# EasyEDA schematic SCH_AB1805_2025-06-08.json
TITLE: Tarjeta electrónica LURMIS; REV: 1.0; Date: 2024-08-15; Sheet: 1/1; Company: UNIR
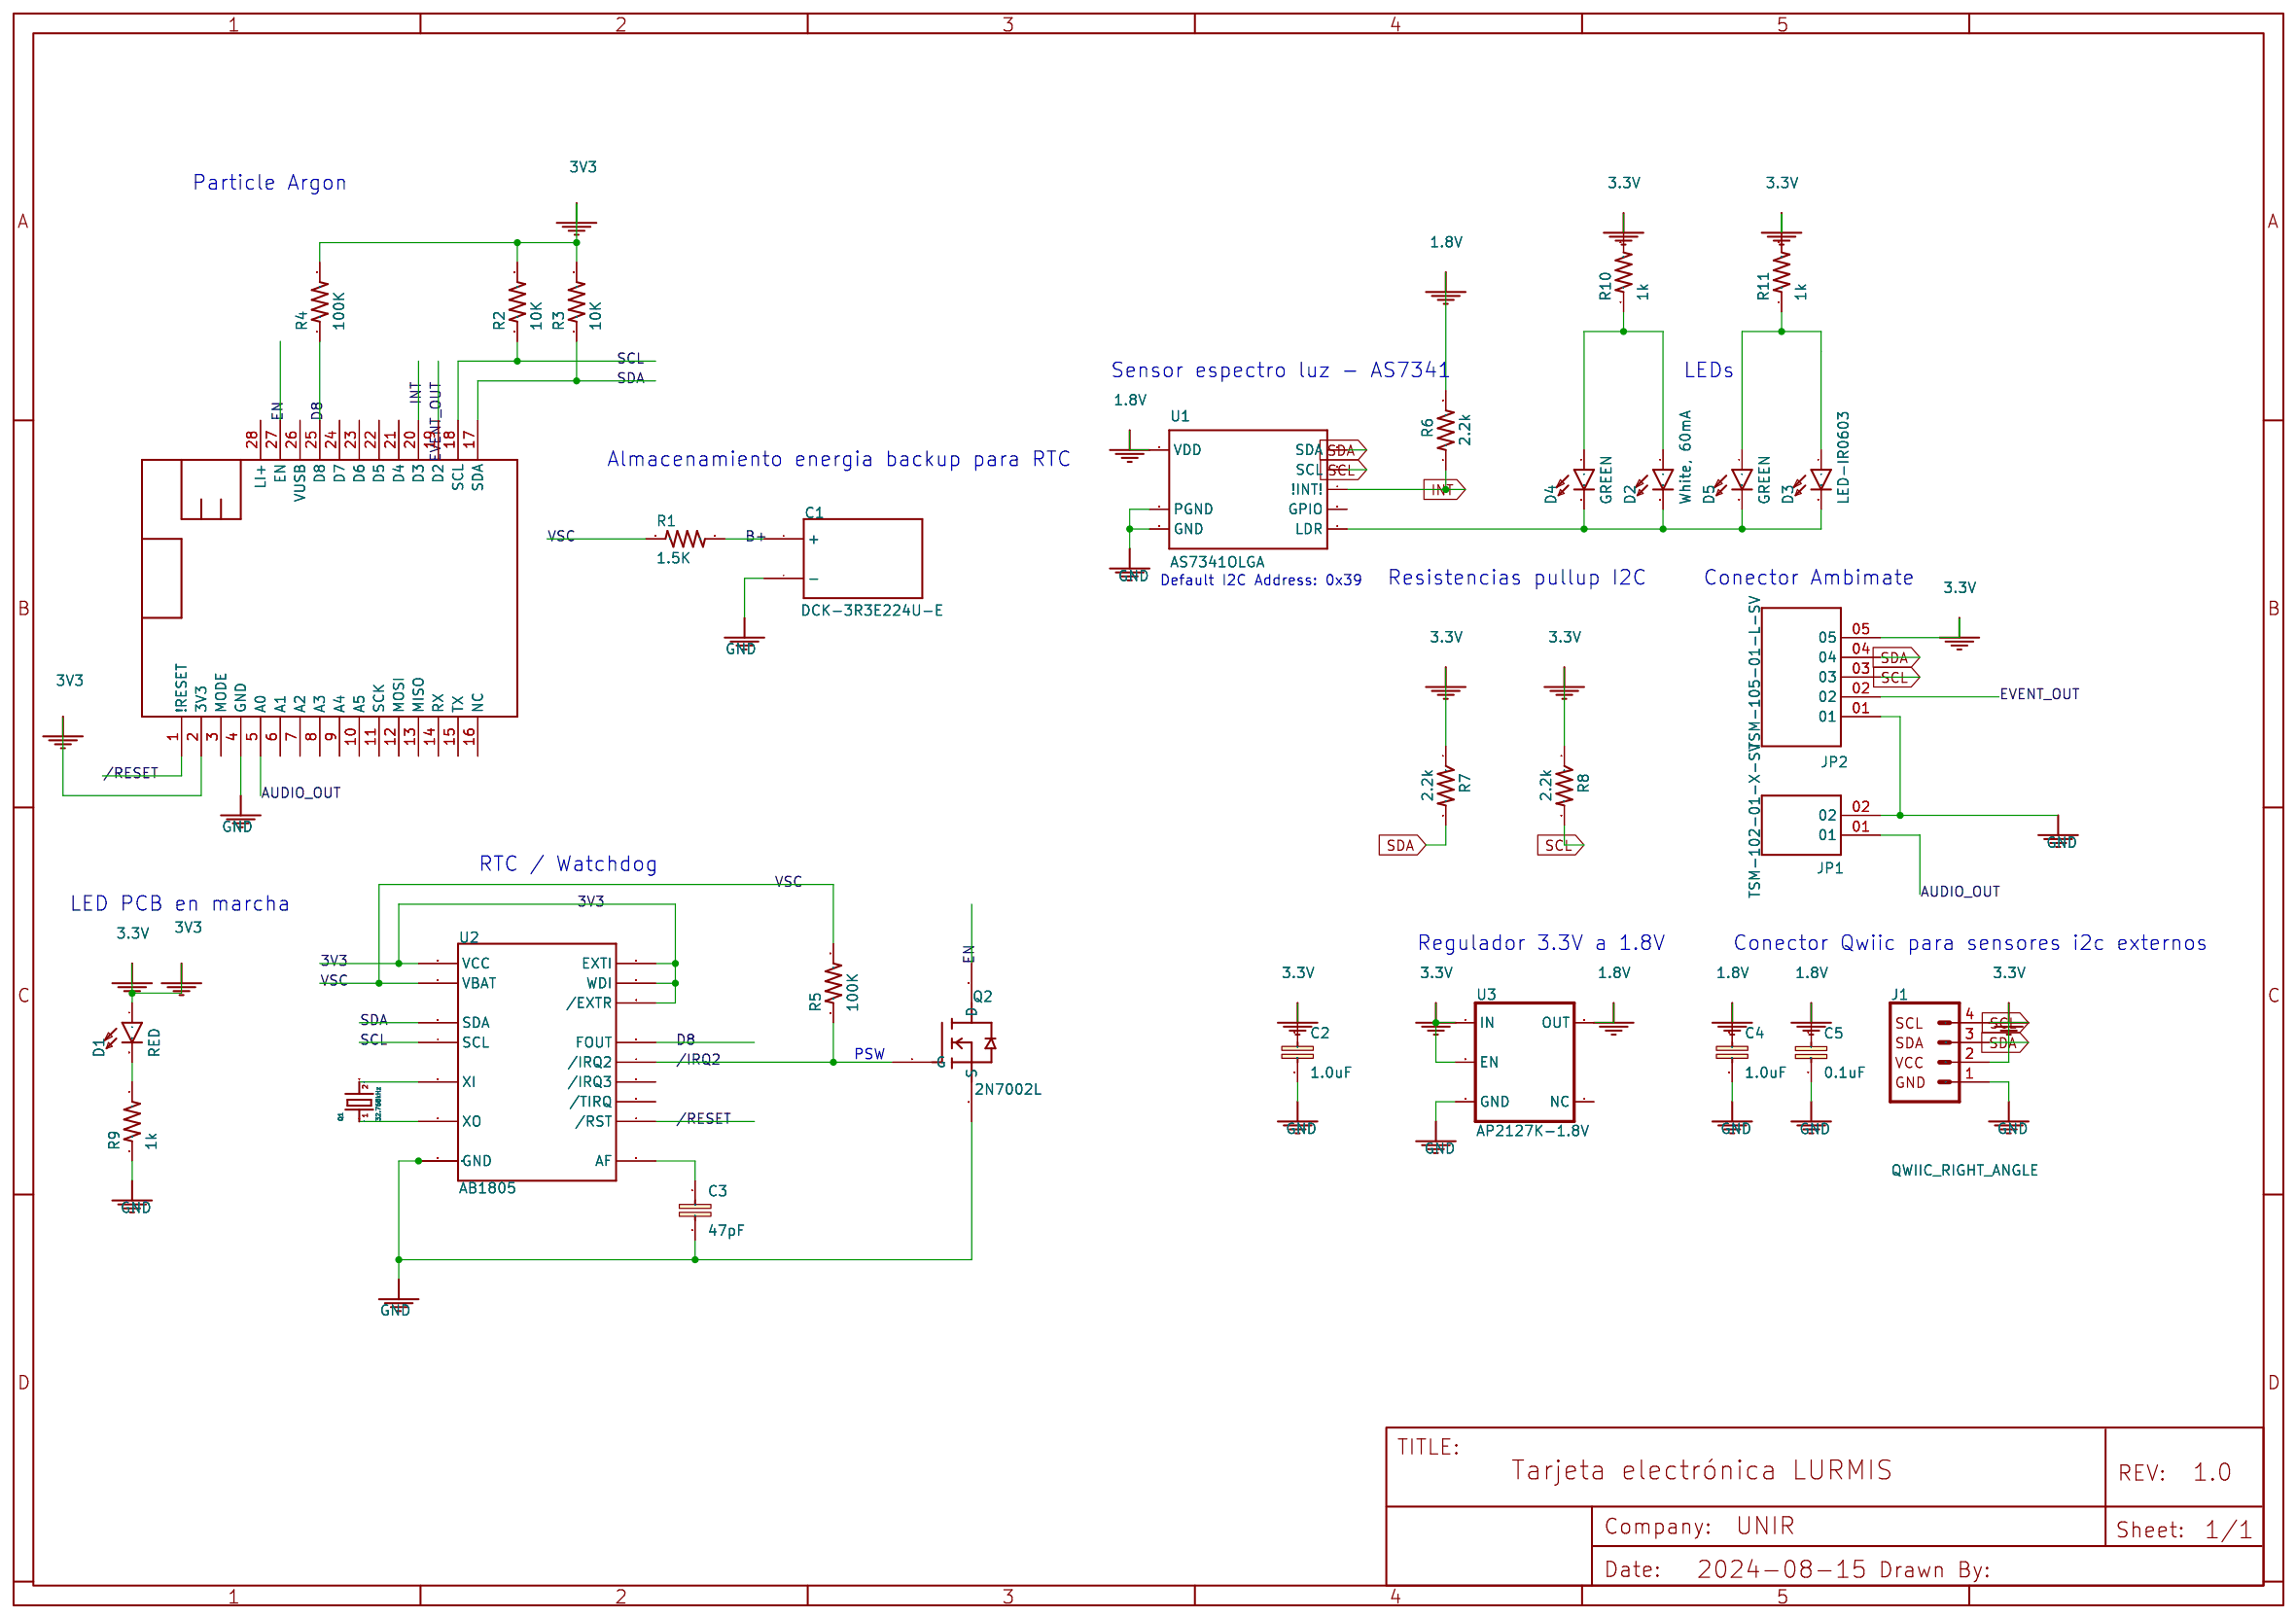
[diagram p0: schematic sheet]

## Parts
C1  DCK-3R3E224U-E  [SUPERCAP-DCK-3R3E224U-E]
C2  1.0uF  [0603]
C3  47pF  [0603-CAP]
C4  1.0uF  [0603]
C5  0.1uF  [0603]
D1  RED  [LED-0603]
D2  White, 60mA  [SUPER_BRIGHT_SMD_LED_3014]
D3  LED-IR0603  [LED-0603]
D4  GREEN  [LED-0603]
D5  GREEN  [LED-0603]
J1  QWIIC_RIGHT_ANGLE  [JST04_1MM_RA]
JP1  TSM-102-01-X-SV  [SAMTEC_TSM-102-01-X-SV]
JP2  TSM-105-01-L-SV  [SAMTEC_TSM-105-01-L-SV]
MS1  FEATHERWING_NODIM  [FEATHERWING_NODIM]
Q1  32.768kHz  [ABS07-120-CRYSTAL]
Q2  2N7002L  [2N7002L]
R1  1.5K  [0603-RES]
R2  10K  [0603-RES]
R3  10K  [0603-RES]
R4  100K  [0603-RES]
R5  100K  [0603-RES]
R6  2.2k  [0603]
R7  2.2k  [0603]
R8  2.2k  [0603]
R9  1k  [0603]
R10  1k  [0603]
R11  1k  [0603]
U1  AS7341OLGA  [OLGA8]
U2  AB1805  [16-VFQFN-ABRACON]
U3  AP2127K-1.8V  [SOT23-5]

## Nets
1.8V: C4.1 C5.1 R6.2 U1.1(VDD) U3.5(OUT)
3.3V: C2.1 D1.A J1.2 JP2.05 MS1.2(3V3) R2.2 R3.2 R4.2 R7.1 R8.1 R10.2 R11.2 U2.2(WDI) U2.3(/EXTR) U2.10(EXTI) U2.13(VCC) U3.1(IN) U3.3(EN)
GND: C1.- C2.2 C3.2 C4.2 C5.2 J1.1 JP1.02 JP2.01 MS1.4(GND) Q2.2(S) R9.1 U1.3(GND) U1.5(PGND) U2.9(GND) U2.EP(GND) U3.2(GND)
/IRQ2: Q2.1(G) R5.1 U2.4(/IRQ2)
/RESET: MS1.1(!RESET) U2.1(/RST)
AUDIO_OUT: JP1.01 MS1.5(A0)
B+: C1.+ R1.2
D8: MS1.25(D8) R4.1 U2.11(FOUT)
EN: MS1.27(EN) Q2.3(D)
EVENT_OUT: JP2.02 MS1.19(D2)
INT: MS1.20(D3) R6.1 U1.7(!INT!)
SCL: J1.4 JP2.03 MS1.18(SCL) R2.1 R8.2 U1.2(SCL) U2.7(SCL)
SDA: J1.3 JP2.04 MS1.17(SDA) R3.1 R7.2 U1.8(SDA) U2.6(SDA)
VSC: R1.1 R5.2 U2.5(VBAT)
AF: C3.1 U2.14(AF)
D1_1: D1.C R9.2
LDR: D2.C D3.C D4.C D5.C U1.4(LDR)
R10_1: D2.A D4.A R10.1
R11_1: D3.A D5.A R11.1
XI: Q1.2 U2.16(XI)
XO: Q1.1 U2.15(XO)

Not connected (* = marked no-connect by the designer): MS1 3(MODE) 6(A1) 7(A2) 8(A3) 9(A4) 10(A5) 11(SCK) 12(MOSI) 13(MISO) 14(RX) 15(TX) 16(NC) 21(D4) 22(D5) 23(D6) 24(D7) 26(VUSB) 28(LI+); U1 6(GPIO); U2 8(/IRQ3) 12(/TIRQ); U3 4(NC)

## Notes on the sheet
- Particle Argon
- Sensor espectro luz - AS7341
- LEDs
- Almacenamiento energia backup para RTC
- Default I2C Address: 0x39
- Resistencias pullup I2C
- Conector Ambimate
- RTC / Watchdog
- LED PCB en marcha
- Regulador 3.3V a 1.8V
- Conector Qwiic para sensores i2c externos
- PSW
